# EAGLE design ethernetGateway (EAGLE 6.5.0)
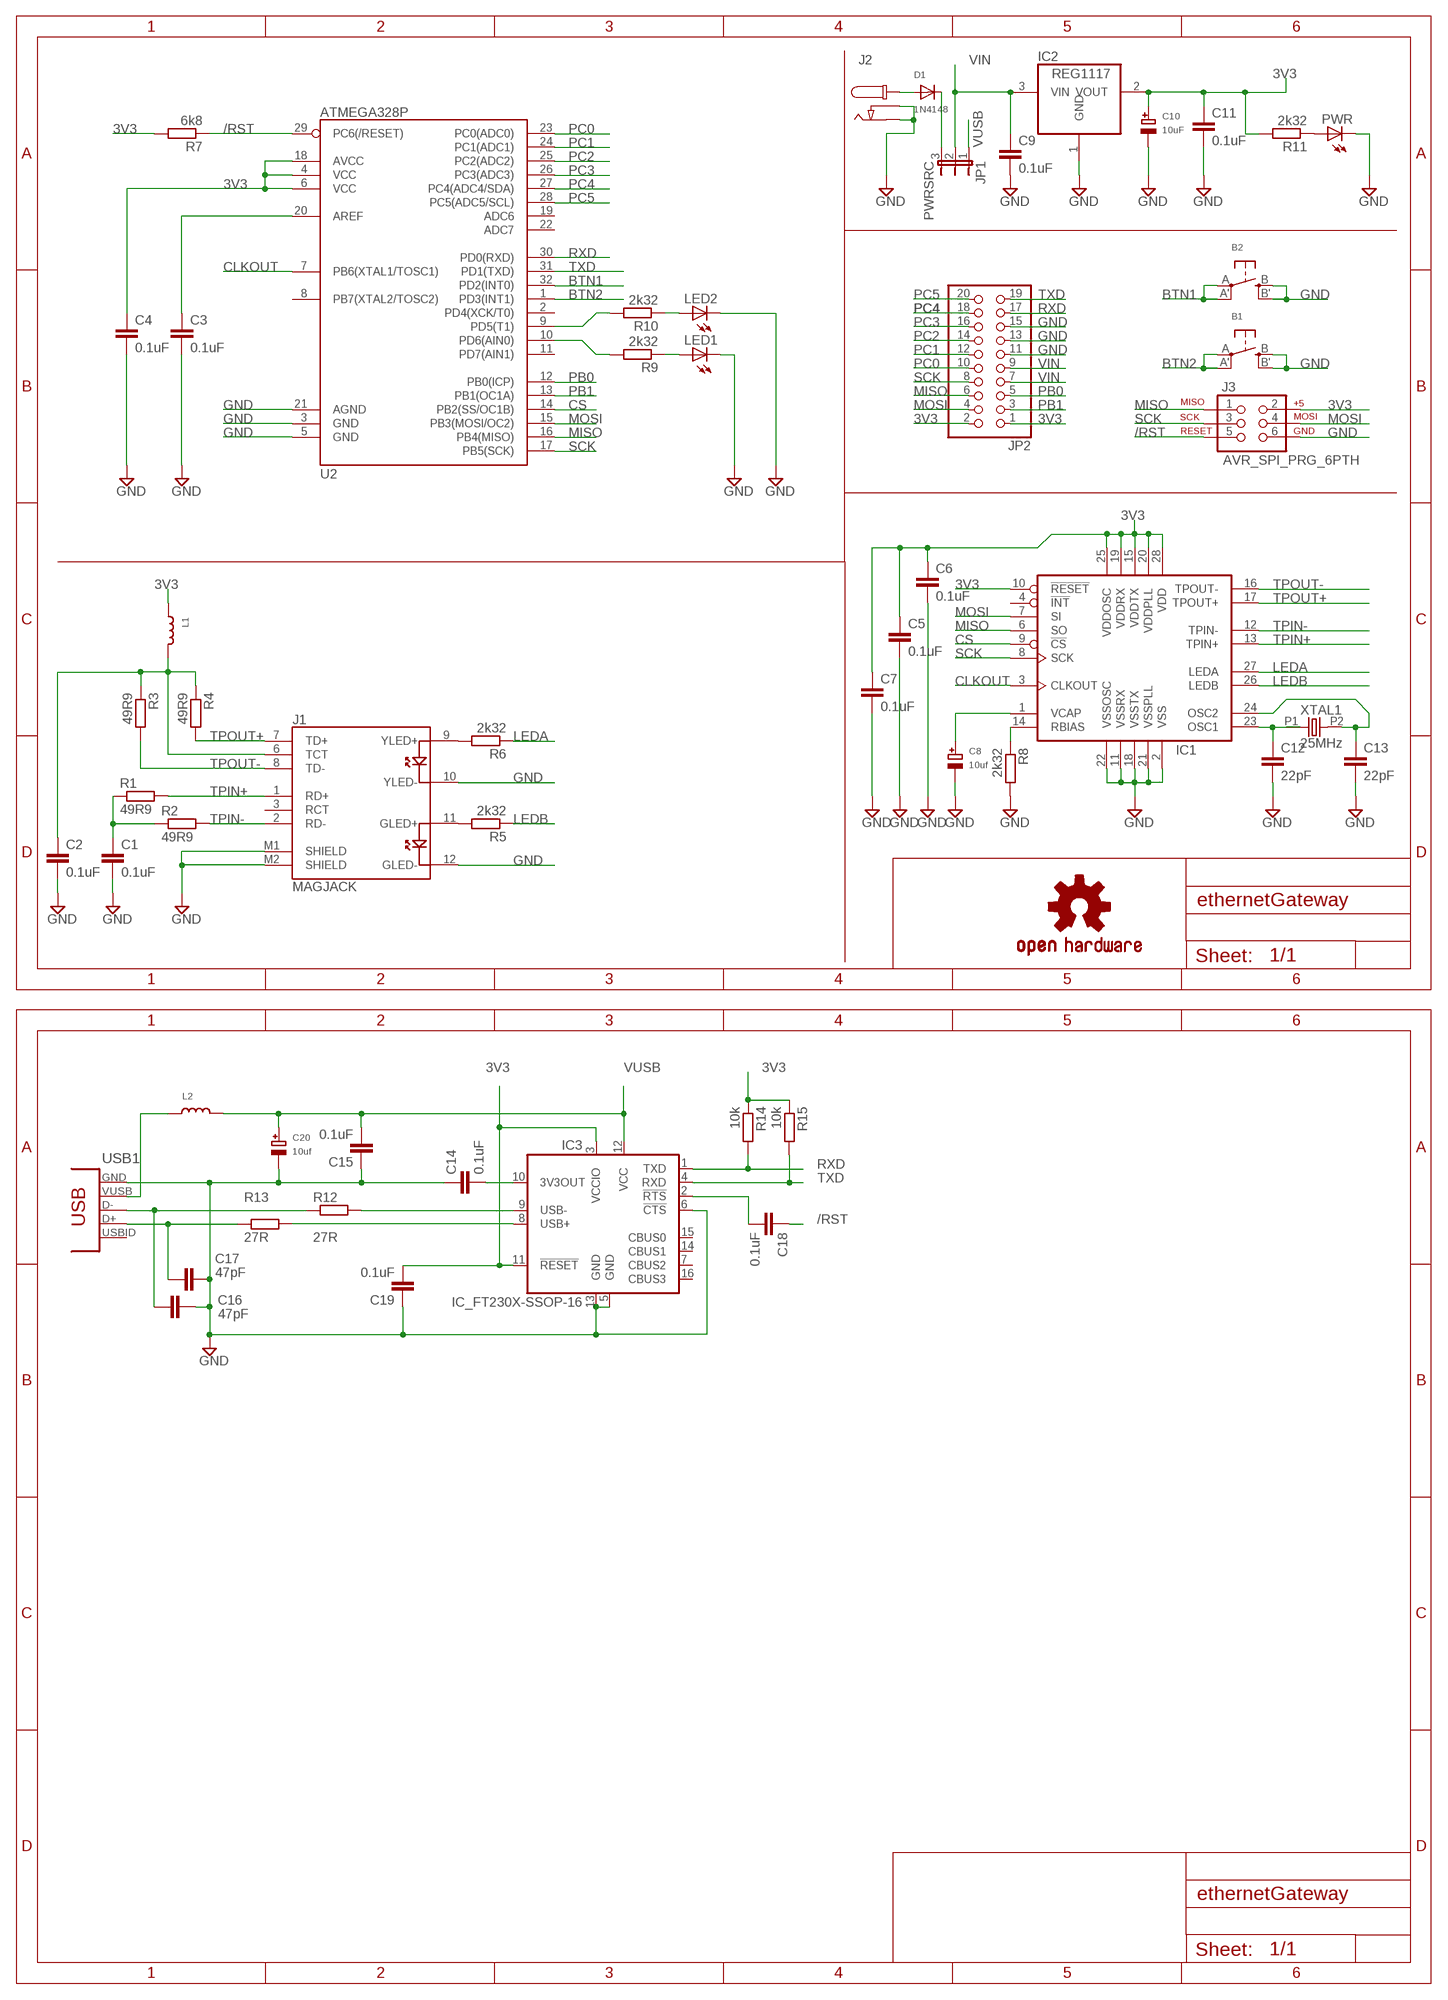
[diagram p0: schematic, sheet 1]

## Parts
B1  SWITCH_TACT_SMT4.6X2.8  [BTN_KMR2_4.6X2.8]
B2  SWITCH_TACT_SMT4.6X2.8  [BTN_KMR2_4.6X2.8]
C1  0.1uF  C-EUC0805  [C0805]
C2  0.1uF  C-EUC0805  [C0805]
C3  0.1uF  C-EUC0805  [C0805]
C4  0.1uF  C-EUC0805  [C0805]
C5  0.1uF  C-EUC0805  [C0805]
C6  0.1uF  C-EUC0805  [C0805]
C7  0.1uF  C-EUC0805  [C0805]
C8  10uf  CAP_TANTALUMD/7343_REFLOW  [EIA7343-31/D-R]
C9  0.1uF  C-EUC0805  [C0805]
C10  10uF  CAP_TANTALUMD/7343_REFLOW  [EIA7343-31/D-R]
C11  0.1uF  C-EUC0805  [C0805]
C12  22pF  C-EUC0805  [C0805]
C13  22pF  C-EUC0805  [C0805]
C14  0.1uF  C-EUC0805  [C0805]
C15  0.1uF  C-EUC0805  [C0805]
C16  47pF  C-EUC0805  [C0805]
C17  47pF  C-EUC0805  [C0805]
C18  0.1uF  C-EUC0805  [C0805]
C19  0.1uF  C-EUC0805  [C0805]
C20  10uf  CAP_TANTALUMD/7343_REFLOW  [EIA7343-31/D-R]
D1  1N4148  DIODESMA  [SMADIODE]
IC1  IC_ENC28J60-SOIC-28  [SOIC-28W]
IC2  REG1117  [SOT223]
IC3  IC_FT230X-SSOP-16  [SSOP-16-FTDI]
J1  MAGJACK  [MAGJACK]
J2  CON_DC_M-DC_PTH  [DC_BARREL_JACK_PTH_2MM]
J3  AVR_SPI_PRG_6PTH  [2X3]
JP1  PWRSRC  JP2W  [JP2W]
JP2  PINHD-2X10  [2X10]
L1  INDUCTOR0805  [0805]
L2  INDUCTOR0805  [0805]
LED1  LED-0805  [LED-805]
LED2  LED-0805  [LED-805]
LOGO1  OSHW-LOGOL  [OSHW-LOGO-L]
PWR  LED-0805  [LED-805]
R1  49R9  R-EU_R0805  [R0805]
R2  49R9  R-EU_R0805  [R0805]
R3  49R9  R-EU_R0805  [R0805]
R4  49R9  R-EU_R0805  [R0805]
R5  2k32  R-EU_R0805  [R0805]
R6  2k32  R-EU_R0805  [R0805]
R7  6k8  R-EU_R0805  [R0805]
R8  2k32  R-EU_R0805  [R0805]
R9  2k32  R-EU_R0805  [R0805]
R10  2k32  R-EU_R0805  [R0805]
R11  2k32  R-EU_R0805  [R0805]
R12  27R  R-EU_M0805  [M0805]
R13  27R  R-EU_M0805  [M0805]
R14  10k  R-EU_R0805  [R0805]
R15  10k  R-EU_R0805  [R0805]
U2  ATMEGA328P  ATMEGA328_SMT  [TQFP32-08]
USB1  CON-USB-F-MINI-B  [CONN_USB_MINI-B]
XTAL1  25MHz  OSC-XTAL-HC-49U-PTH  [HC-49U-PTH]

## Nets
3V3: C4.1 C5.1 C6.1 C7.1 C10.+ C11.1 C19.2 IC1.10(!RESET) IC1.15(VDDTX) IC1.19(VDDRX) IC1.20(VDDPLL) IC1.25(VDDOSC) IC1.28(VDD) IC2.2(VOUT) IC3.3(VCCIO) IC3.11(!RESET) J3.2 JP2.1 JP2.2 L1.1 R7.2 R11.2 R14.1 R15.1 U2.4(VCC) U2.6(VCC) U2.18(AVCC)
/RST: C18.1 J3.5 R7.1 U2.29(PC6(/RESET))
BTN1: B2.A'(P1) B2.A(P) U2.32(PD2(INT0))
BTN2: B1.A'(P1) B1.A(P) U2.1(PD3(INT1))
CLKOUT: IC1.3(CLKOUT) U2.7(PB6(XTAL1/TOSC1))
CS: IC1.9(!CS) U2.14(PB2(SS/OC1B))
GND: B1.B'(S1) B1.B(S) B2.B'(S1) B2.B(S) C1.2 C2.2 C3.2 C4.2 C5.2 C6.2 C7.2 C8.- C9.2 C10.- C11.2 C12.2 C13.2 C14.1 C15.1 C16.1 C17.2 C19.1 C20.- IC1.2(VSS) IC1.11(VSSRX) IC1.18(VSSTX) IC1.21(VSSPLL) IC1.22(VSSOSC) IC2.1(GND) IC3.5(GND) IC3.6(!CTS) IC3.13(GND) J1.10(YLED-) J1.12(GLED-) J1.M1(SHIELD) J1.M2(SHIELD) J2.P2(P3) J2.P3(P2) J3.6 JP2.11 JP2.13 JP2.15 LED1.C LED2.C PWR.C R8.2 U2.3(GND) U2.5(GND) U2.21(AGND) USB1.GND
LEDA: IC1.27(LEDA) R6.1
LEDB: IC1.26(LEDB) R5.1
MISO: IC1.6(SO) J3.1 JP2.6 U2.16(PB4(MISO))
MOSI: IC1.7(SI) J3.4 JP2.4 U2.15(PB3(MOSI/OC2))
N$1: C1.1 R1.1 R2.1
N$2: J1.9(YLED+) R6.2
N$3: C13.1 IC1.24(OSC2) XTAL1.P2
N$4: J1.11(GLED+) R5.2
N$5: C12.1 IC1.23(OSC1) XTAL1.P1
N$6: C16.2 R12.1 USB1.D-
N$7: C2.1 J1.6(TCT) L1.2 R3.1 R4.1
N$8: C17.1 R13.1 USB1.D+
N$9: IC3.9(USB-) R12.2
N$10: C8.+ IC1.1(VCAP)
N$11: IC3.8(USB+) R13.2
N$12: C3.1 U2.20(AREF)
N$13: IC1.14(RBIAS) R8.1
N$14: L2.1 USB1.VUSB
N$15: C14.2 IC3.10(3V3OUT)
N$16: LED1.A R9.1
N$17: LED2.A R10.1
N$18: D1.C JP1.3
N$19: D1.A J2.P1
N$20: C18.2 IC3.2(!RTS)
N$23: R10.2 U2.9(PD5(T1))
N$24: R9.2 U2.10(PD6(AIN0))
N$28: PWR.A R11.1
PB0: JP2.5 U2.12(PB0(ICP))
PB1: JP2.3 U2.13(PB1(OC1A))
PC0: JP2.10 U2.23(PC0(ADC0))
PC1: JP2.12 U2.24(PC1(ADC1))
PC2: JP2.14 U2.25(PC2(ADC2))
PC3: JP2.16 U2.26(PC3(ADC3))
PC4: JP2.18 U2.27(PC4(ADC4/SDA))
PC5: JP2.20 U2.28(PC5(ADC5/SCL))
RXD: IC3.1(TXD) JP2.17 R14.2 U2.30(PD0(RXD))
SCK: IC1.8(SCK) J3.3 JP2.8 U2.17(PB5(SCK))
TPIN+: IC1.13(TPIN+) J1.1(RD+) R1.2
TPIN-: IC1.12(TPIN-) J1.2(RD-) R2.2
TPOUT+: IC1.17(TPOUT+) J1.7(TD+) R4.2
TPOUT-: IC1.16(TPOUT-) J1.8(TD-) R3.2
TXD: IC3.4(RXD) JP2.19 R15.2 U2.31(PD1(TXD))
VIN: C9.1 IC2.3(VIN) JP1.2 JP2.7 JP2.9
VUSB: C15.2 C20.+ IC3.12(VCC) JP1.1 L2.2
Unconnected: IC1.4(!INT) IC3.7(CBUS2) IC3.14(CBUS1) IC3.15(CBUS0) IC3.16(CBUS3) J1.3(RCT) U2.2(PD4(XCK/T0)) U2.8(PB7(XTAL2/TOSC2)) U2.11(PD7(AIN1)) U2.19(ADC6) U2.22(ADC7) USB1.BODY@1(BODY) USB1.BODY@2(BODY) USB1.BODY@3(BODY) USB1.BODY@4(BODY) USB1.ID(USBID)

## Library data of the parts
B1 B2 = microbuilder:SWITCH_TACT_SMT: SMT Tact Switches 6x6mm - Digikey: P12940SCT-ND KMR2 (4.6x2.8mm) - Digikey: 401-1426-1-ND EVQ-PQHB55 - Light Touch, 160GF (4.5x4.5mm) - Digikey: P8090SCT-ND
C1-C7 C9 C11-C19 = rcl:C-EU: CAPACITOR, European symbol
C8 C10 C20 = microbuilder:CAP_TANTALUM: Tantalum Capacitors Wave footprints have larger pads and are meant to be used for hand soldering. Reflow footprints are optimised for solder paste and a reflow oven. EIA3216-18/A-[R/W] - Size A / 3216-18 / 1206 footprint 4.7µF 25V 10% Tantalum Capacitor 10µF 16V 10% Tantalum Capacitor [Digikey: 495-2236-2-ND] EIA3528-21/B-[R/W] - Size B / 3528-21 47µF 10V 10% Tantalum Capactior [Digikey: 495-2216-1-ND] EIA6032-28/C-[R/W] - Size C / 6032-28 10µF 35V 20% Tantalum Capacitor [Digikey: 495-2285-1-ND] 100µF 16V 10% Tantalum Capactior [Digikey: 399-5214-1-ND]
D1 = microbuilder:DIODE: Diode SMA Model Volts Amps Type Vf Vr Digikey # Notes SSA34-E3 40V 3A Schottky 480mV @ 3A 200uA @ 40V SSA34-E3/61TGITR-ND CDBA120-G 20V 1A Schottky 500mV @ 1A 500uA @ 20V 641-1014-6-ND REEL MBRA210 10V 2A Schottky 350mV @ 2A 700uA @ 10V MBRA210LT3 SOD-123 Model Volts Amps Type Vf Vr Order # Notes BAT54T1G 30V 200mA Schottky 800mV @ 200mA 2uA @ 25V BAT54T1GOSTR-ND B0530W 30V 500mA Schottky 430mV @ 500mA 130uA @ 30V B0530W-FDICT-ND REEL MBR120 1A 20V Schottky 340mV @ 1A MBR120VLSFT1GOSCT-ND SOD-323 Model Volts Amps Type Vf Vr Order # Notes PMEG2005EJ 20V 500mA Schottky 355mV @ 500mA 568-4110-1-ND ZLLS410 10V 570mA Schottky 380mV @ 570mA ZLLS410CT-ND 1N4148WS 75V 150mA Silicon/Simple 1V 1N4148WSFSCT-ND REEL SOD-523 Model Volts Amps Type Vf Vr Order # Notes BAT54XV2 30V 200mA Schottky 0.8V @ 100mA BAT54XV2CT-ND TB751S 30V 30mA Schottky RB751S-40TE61CT-ND SOT23-R/W (R = Solder Paste/Reflow Ovens, W = Hand-Soldering) Model Volts Amps Type Vf Vr Order # Notes BAT54FILM 40V 300mA Schottky 497-7162-1-ND
IC1 = dp_devices:IC_ENC28J60: Ethernet Controller with SPI Interface
IC2 = burr-brown:REG1117: 800mA and 1A Low Dropout (LDO) Positive Regulator 1.8V, 2.5V, 2.85V, 3.3V, 5V, and Adj; MPN: REG1117; OC_FARNELL: 1097566; OC_NEWARK: 14P6981
IC3 = dp_devices:IC_FT230X: BASIC USB to UART IC
J1 = SparkFun-Connectors:MAGJACK: RJ-45 with LEDs
J2 = dp_devices:CON_DC_M: DC power connector
J3 = SparkFun-Connectors:AVR_SPI_PRG_6: AVR ISP 6 Pin This is the reduced ISP connector for AVR programming. Common on Arduino. This footprint will take up less PCB space and can be used with a 10-pin to 6-pin adapter such as SKU: BOB-08508
JP1 = jumper:JP2W: JUMPER
JP2 = pinhead:PINHD-2X10: PIN HEADER
L1 L2 = microbuilder:INDUCTOR: Inductors 0603: 10nH Ceramic Inductor - microwire antenna/RF (Digikey: 712-1434-2-ND) 0805: 560nH Ceramic Inductor - RF (Digikey: 553-1047-1-ND) 270nH Ceramic Inductor - Q = 40@250MHz, +-5%, 1 Ohm DC Resistance (Digikey: 535-10506-2-ND) 1007 (2518 Metric) SMT: 10µH 10% 250mOhm 820mA 1007 Inductor (Digikey: 587-2189-1-ND) 22µH 10% 500mOhm 580mA 1007 Inductor (Digikey: 587-2190-1-ND) 47µH 10% 950mOhm 420mA 1007 Inductor (Digikey: 587-2191-1-ND) 47µH 5% 100mOhm 1A 1008 Inductor (Digikey: 732-1816-1-ND) 5.0x5.0mm (Taiyo Yuden NR5040 Series) 6.8µH 20% 2.3A 64mOhm Inductor (Digikey: 587-2374-2-ND) 5.0x5.0mm (TDK VLC5045 Series) 4.7µH 20% 3.3A 34mOhm Inductor (Digikey: 445-6526-1-ND) 6.8µH 20% 2.7A 46mOhm Inductor (Digikey: 445-6527-1-ND) 6.0x6.0mm (TDK VLC6045 Series) 4.7µH 20% 3.8A 27mOhm Inductor (Digikey: 445-6538-2-ND) 6.8µH 20% 3A 41mOhm Inductor (Digikey: 445-6540-1-ND) 6.2µH 30% 2.2A 45mOhm Inductor (Digikey: SRR5028-6R2YCT-ND) - Not TDK VLC6045 but footprint should match 6.0x6.0mm (TDK SLF6045 Series) 6.8uH 30% 2A 33mOhm Inductor (Digikey: 445-4572-1-ND, Mouser: 810-SLF645T6R8N2R0PF)
LED1 LED2 PWR = dp_devices:LED: Light Emitting Diode
LOGO1 = SparkFun-Aesthetics:OSHW-LOGO: Open Source Hardware Logo This logo indicates the piece of hardware it is found on incorporates a OSHW license and/or adheres to the definition of open source hardware found here: http://freedomdefined.org/OSHW
R1-R15 = rcl:R-EU_: RESISTOR, European symbol
U2 = SparkFun-DigitalIC_ihsan:ATMEGA328_SMT: 32-Pin Atmega328 part Commonly used on Arduino compatible boards Available in QFP and QFN packages TQFP is IC-09069 QFN is non-stock; PROD_ID: IC-09069
USB1 = dp_devices:CON-USB-F: USB Female connector
XTAL1 = dp_devices:OSC-XTAL

## Board
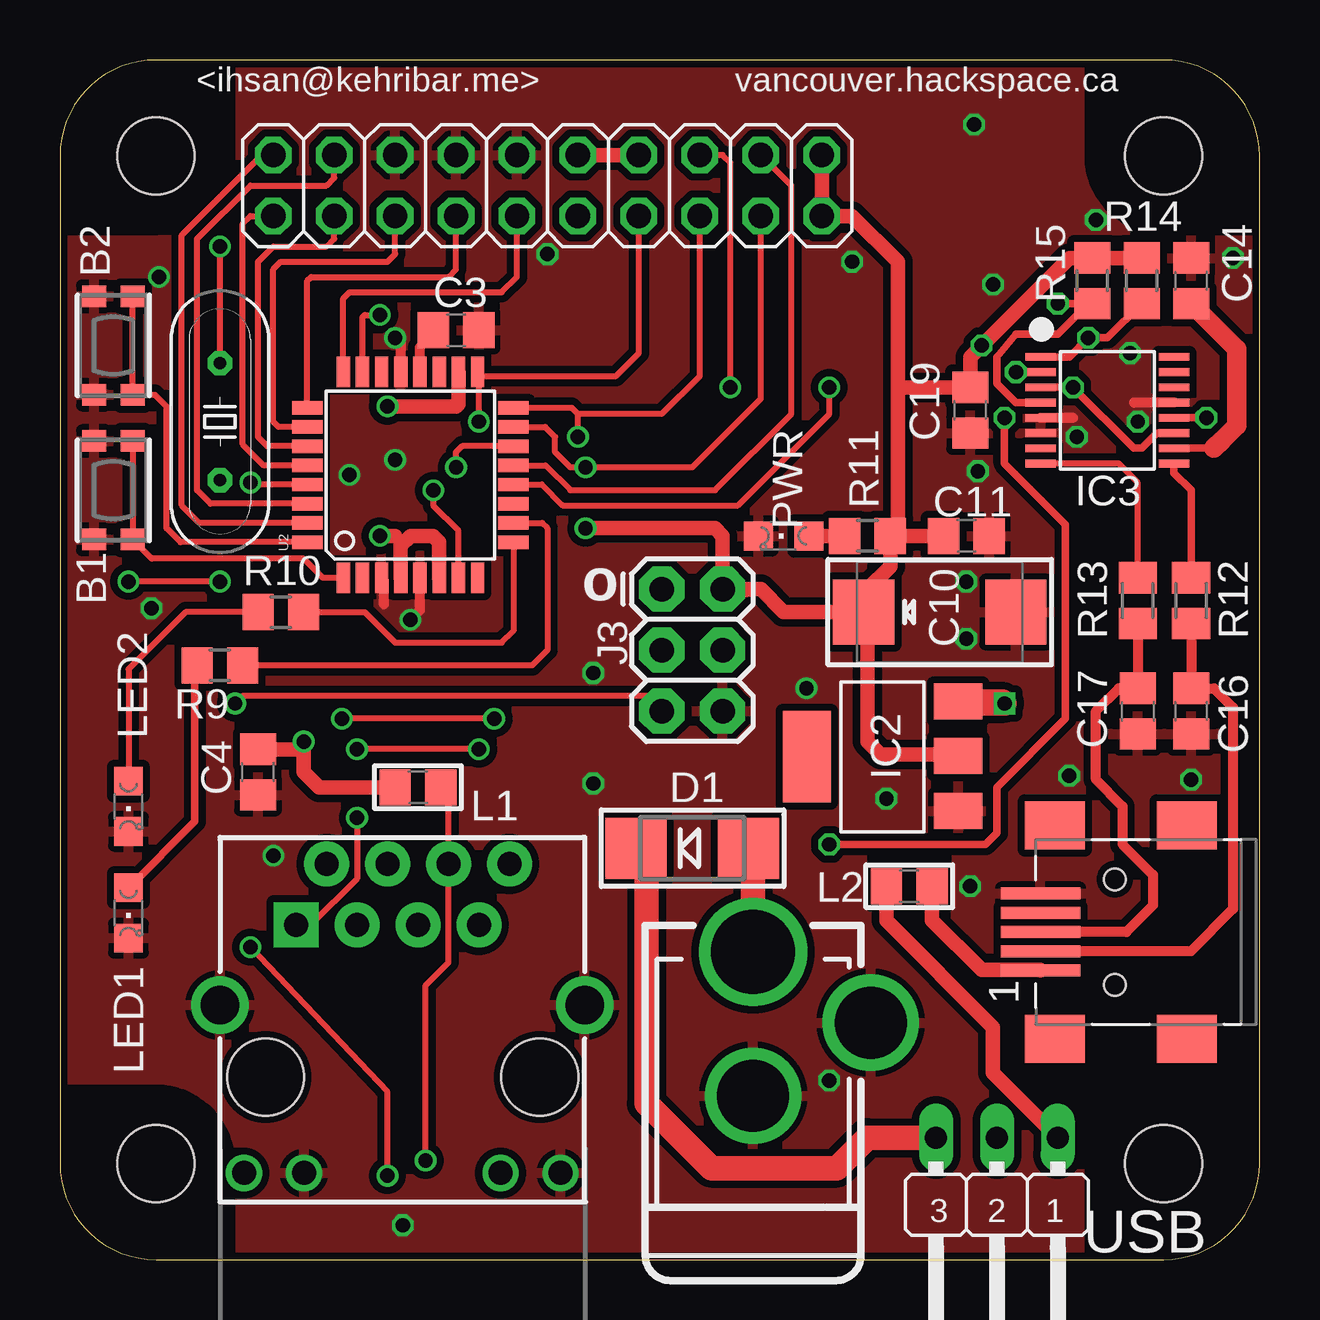
[diagram p1: board, top side]
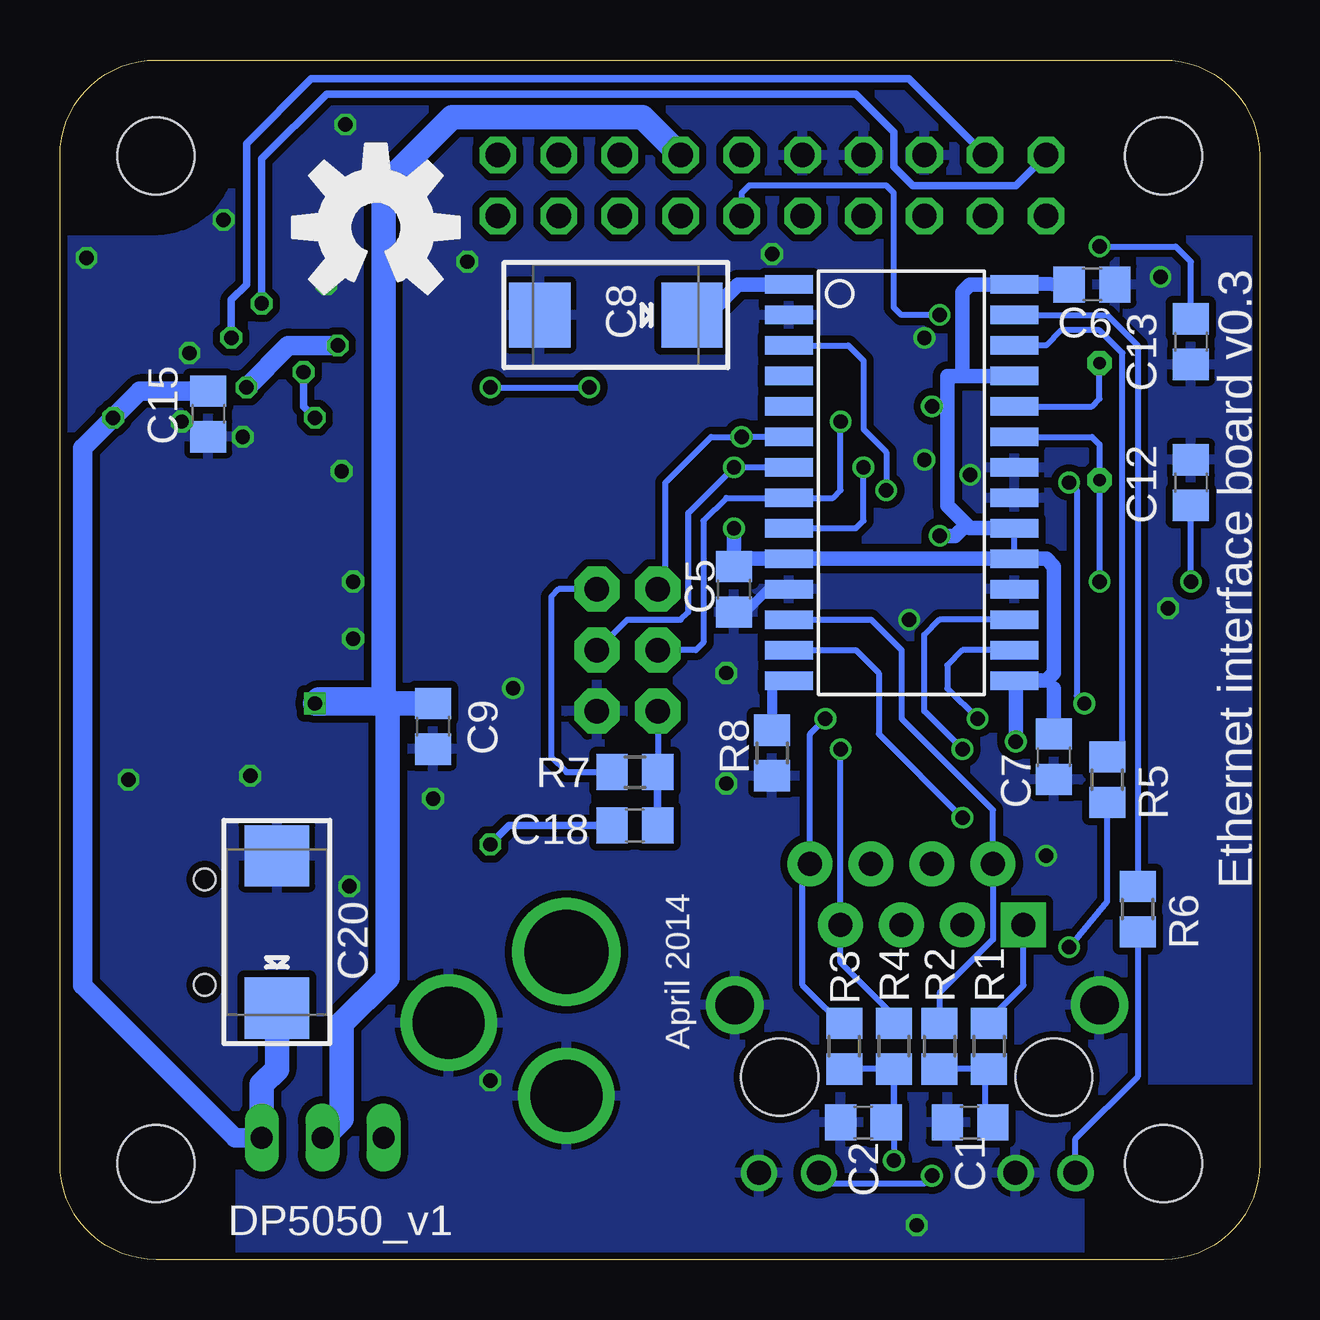
[diagram p2: board, bottom side, seen from below]

Size 50 x 50 mm. Coordinates in mm from the lower left corner, seen from the top.
Copper layers (1*16): Top 0.035mm / dielectric 1.5mm / Bottom 0.035mm
Design rules "ITEADstudio_DRC": minimum track width 6mil, minimum drill 12mil, track to track 6mil, track to pad 6mil, pad to pad 6mil, via to via 6mil, smd to smd 0mil, copper to edge 10mil, drill to drill 10mil, minimum pad ring 10mil, minimum via ring 6mil, stop-mask expansion 2mil, vias tented up to drill 100mil, thermal gap 10mil

### Footprints (pad centres in the part's own frame; a part is rotated, then mirrored left to right if it is on the bottom)
BTN_KMR2_4.6X2.8 = smd 0.9 x 1: A 2.05,0.8; A' -2.05,0.8; B 2.05,-0.8; B' -2.05,-0.8
C0805 = smd 1.3 x 1.5: 1 -0.95,0; 2 0.95,0
EIA7343-31/D-R = smd 2.55 x 2.7: + 3.175,0; - -3.175,0
SMADIODE = smd 2.54 x 2.54: A 2.349,0; C -2.349,0
SOIC-28W = smd 0.762 x 2: 1 -8.89,-4.7; 2 -7.62,-4.7; 3 -6.35,-4.7; 4 -5.08,-4.7; 5 -3.81,-4.7; 6 -2.54,-4.7; 7 -1.27,-4.7; 8 0,-4.7; 9 1.27,-4.7; 10 2.54,-4.7; 11 3.81,-4.7; 12 5.08,-4.7; 13 6.35,-4.7; 14 7.62,-4.7; 15 7.62,4.7; 16 6.35,4.7; 17 5.08,4.7; 18 3.81,4.7; 19 2.54,4.7; 20 1.27,4.7; 21 0,4.7; 22 -1.27,4.7; 23 -2.54,4.7; 24 -3.81,4.7; 25 -5.08,4.7; 26 -6.35,4.7; 27 -7.62,4.7; 28 -8.89,4.7
SOT223 = smd 1.499 x 2.007: 1 -2.261,-3.15; 2 0.025,-3.15; 3 2.311,-3.15 | smd 3.81 x 2.007: 4 0,3.15
SSOP-16-FTDI = smd 0.32 x 1.26: 1 -2.223,-2.779; 2 -1.588,-2.779; 3 -0.953,-2.779; 4 -0.318,-2.779; 5 0.317,-2.779; 6 0.952,-2.779; 7 1.587,-2.779; 8 2.222,-2.779; 9 2.222,2.779; 10 1.587,2.779; 11 0.952,2.779; 12 0.317,2.779; 13 -0.318,2.779; 14 -0.953,2.779; 15 -1.588,2.779; 16 -2.223,2.779
MAGJACK = drill 1 pad 1.88 square: 1 3.175,17.445 | drill 1 pad 1.88: 2 4.445,19.985; 3 5.715,17.445; 4 6.985,19.985; 5 8.255,17.445; 6 9.525,19.985; 7 10.795,17.445; 8 12.065,19.985 | drill 1 pad 1.27: 9 1,7.1; 10 3.5,7.1; 11 11.7,7.1; 12 14.2,7.1 | drill 1.6 pad 2.184: M1 0,14.1; M2 15.2,14.1 | hole 3.2: 1.905,11.095; 13.335,11.095
DC_BARREL_JACK_PTH_2MM = drill 3.5: P1 0,6.475 | drill 3: P2 4.9,3.525; P3 0,0.475
2X3 = drill 1.016 pad 1.88 octagon: 1 0,0; 2 0,2.54; 3 2.54,0; 4 2.54,2.54; 5 5.08,0; 6 5.08,2.54
JP2W = drill 0.914 long: 1 -2.54,-1.27; 2 0,-1.27; 3 2.54,-1.27
2X10 = drill 1.016 octagon: 1 -11.43,-1.27; 2 -11.43,1.27; 3 -8.89,-1.27; 4 -8.89,1.27; 5 -6.35,-1.27; 6 -6.35,1.27; 7 -3.81,-1.27; 8 -3.81,1.27; 9 -1.27,-1.27; 10 -1.27,1.27; 11 1.27,-1.27; 12 1.27,1.27; 13 3.81,-1.27; 14 3.81,1.27; 15 6.35,-1.27; 16 6.35,1.27; 17 8.89,-1.27; 18 8.89,1.27; 19 11.43,-1.27; 20 11.43,1.27
0805 = smd 1.3 x 1.5: 1 -0.95,0; 2 0.95,0
LED-805 = smd 1.2 x 1.2: A 0,-1.05; C 0,1.05
R0805 = smd 1.3 x 1.5: 1 -0.95,0; 2 0.95,0
M0805 = smd 1.3 x 1.6: 1 -0.95,0; 2 0.95,0
TQFP32-08 = smd 1.27 x 0.559: 1 -4.293,2.8; 2 -4.293,2; 3 -4.293,1.2; 4 -4.293,0.4; 5 -4.293,-0.4; 6 -4.293,-1.2; 7 -4.293,-2; 8 -4.293,-2.8; 17 4.293,-2.8; 18 4.293,-2; 19 4.293,-1.2; 20 4.293,-0.4; 21 4.293,0.4; 22 4.293,1.2; 23 4.293,2; 24 4.293,2.8 | smd 0.559 x 1.27: 9 -2.8,-4.293; 10 -2,-4.293; 11 -1.2,-4.293; 12 -0.4,-4.293; 13 0.4,-4.293; 14 1.2,-4.293; 15 2,-4.293; 16 2.8,-4.293; 25 2.8,4.293; 26 2,4.293; 27 1.2,4.293; 28 0.4,4.293; 29 -0.4,4.293; 30 -1.2,4.293; 31 -2,4.293; 32 -2.8,4.293
DP5050_V1 = hole 3.2: 4,4; 46,4; 46,46; 4,46
CONN_USB_MINI-B = smd 2 x 2.5: BODY@1 -4.45,2.5; BODY@2 4.45,2.5; BODY@3 4.45,-3; BODY@4 -4.45,-3 | smd 0.5 x 3.3: D+ 0,3.1; D- -0.8,3.1; GND 1.6,3.1; ID 0.8,3.1; VUSB -1.6,3.1 | hole 0.9: -2.2,0; 2.2,0
HC-49U-PTH = drill 0.508 octagon: P1 -2.44,0; P2 2.44,0

### Placement (x,y rotation side)
B1  2.22,32.07 270 top
B2  2.22,38.1 270 top
C1  12.06,5.71 180 bottom
C2  16.51,5.71 180 bottom
C3  16.51,38.73 0 top
C4  8.25,20.32 270 top
C5  21.91,27.94 270 bottom
C6  6.99,40.64 0 bottom
C7  8.57,20.96 270 bottom
C8  26.83,39.37 0 bottom
C9  34.45,22.23 270 bottom
C10  36.67,26.99 180 top
C11  37.78,30.16 0 top
C12  2.86,32.38 90 bottom
C13  2.86,38.26 270 bottom
C14  47.15,40.8 270 top
C15  43.81,35.24 90 bottom
C16  47.15,22.86 90 top
C17  44.93,22.86 270 top
C18  26.04,18.1 180 bottom
C19  37.94,35.4 90 top
C20  40.96,13.65 270 bottom
D1  26.35,17.14 0 top
IC1  14.92,31.75 270 bottom
IC2  34.29,20.96 90 top
IC3  43.66,35.4 270 top
J1  6.67,-3.49 0 top
J2  28.89,6.35 0 top
J3  25.08,27.94 270 top
JP1  39.05,3.81 180 top
JP2  20.32,44.77 180 top
L1  14.92,19.69 0 top
L2  35.4,15.56 180 top
LED1  2.86,14.45 180 top
LED2  2.86,18.89 180 top
LOGO1  36.83,43.02 0 bottom
PWR  30.16,30.16 90 top
R1  11.27,8.89 90 bottom
R2  13.33,8.89 90 bottom
R3  17.3,8.89 90 bottom
R4  15.24,8.89 90 bottom
R5  6.35,20 270 bottom
R6  5.08,14.6 270 bottom
R7  26.04,20.32 180 bottom
R8  20.32,21.11 270 bottom
R9  6.67,24.77 0 top
R10  9.21,26.99 0 top
R11  33.65,30.16 0 top
R12  47.15,27.46 90 top
R13  44.93,27.46 90 top
R14  45.09,40.8 270 top
R15  43.02,40.8 270 top
U2  14.6,32.7 90 top
U$1  [DP5050_V1]  0,0 0 top
USB1  43.97,13.65 90 top
XTAL1  6.67,34.93 90 top

### Tracks (layer width: path | path; a pad name or v marks a point on that pad's centre or on a via)
3V3  (via drill 0.6)
  Top 0.254: 14.21,29.93 13.97,30.16
  Top 0.305: IC3.3 v42.23,36.35 44.77,33.81 45.09,33.81 45.72,34.45 IC3.11
  Top 0.61: 14.21,29.76 14.6,30.16 15.56,30.16 15.8,29.92 U2.6 | 13.97,30.16 v13.33,30.16 | v13.65,35.56 16.51,35.56 16.6,35.66 U2.18 | L1.1 10.8,19.69 10.16,20.32 v10.16,21.59 10.16,21.27 C4.1 | v21.91,30.48 27.3,30.48 27.62,30.16 J3.2 | 28.61,27.9 28.89,27.94 J3.2 | JP2.1 JP2.2 33.02,43.5 34.92,41.59 34.92,36.35 | C10.+ 33.65,26.95 33.65,21.59 34.2,21.04 37.44,21.04 IC2.2 | C10.+ 30.16,26.99 29.21,27.94 J3.2 | C11.1 R11.2 | C10.+ 33.62,27.9 34.61,28.89 R11.2 | 34.92,36.35 34.92,30.48 R11.2 | 14.21,29.76 U2.4 | 14.21,29.76 14.21,29.93 | R14.1 R15.1 42.07,41.75 v38.42,38.1 37.94,37.62 C19.2 | C19.2 | C19.2 34.92,36.35
  Bottom 0.254: IC1.19 IC1.20 | 12.07,36.83 12.38,37.15 | 10.16,24.07 IC1.15 | 8.57,23.81 8.89,24.13 | 21.91,29.21 C5.1 | 10.16,40.7 IC1.28 | J3.2 29.21,27.94 29.53,27.62 29.53,20.96 28.89,20.32 R7.2
  Bottom 0.61: IC1.20 12.07,30.48 12.22,30.64 | 12.22,30.64 13.02,31.43 13.02,35.56 | 13.02,35.56 13.02,36.83 12.07,36.83 IC1.25 | 12.38,37.15 12.38,40.32 12.07,40.64 IC1.28 | v10.16,21.59 10.16,24.07 | IC1.15 8.89,24.13 8.57,24.45 8.57,28.89 8.89,29.21 IC1.19 IC1.10 21.91,29.21 | v13.33,30.16 12.7,30.16 12.22,30.64 | v13.65,35.56 13.02,35.56 | C7.1 8.57,23.81 | C6.1 10.16,40.7 | C5.1 v21.91,30.48
  Bottom 0.813: v42.23,36.35 40.48,38.1 v38.42,38.1
/RST  (via drill 0.6)
  Top 0.254: J3.5 25.08,23.18 24.76,23.5 7.62,23.5 v7.3,23.18 | U2.29 8.02,32.3 v7.94,32.38
  Bottom 0.254: J3.5 R7.1 | v7.94,32.38 7.62,32.07 7.62,23.5 v7.3,23.18
  Bottom 0.305: C18.1 R7.1
BTN1
  Top 0.254: U2.32 5.02,29.9 4.45,30.48 4.45,35.56 3.95,36.05 B2.A B2.A'
BTN2
  Top 0.254: B1.A' B1.A 3.83,29.21 10.16,29.21 10.96,28.41 U2.1
CLKOUT  (via drill 0.6)
  Top 0.254: v15.56,32.07 15.56,31.43 16.6,30.39 U2.7
  Bottom 0.254: IC1.3 17.14,38.1 16.51,37.47 16.51,34.61 15.56,33.66 v15.56,32.07
CS  (via drill 0.6)
  Top 0.254: v16.51,33.02 16.51,33.66 16.76,33.9 U2.14
  Bottom 0.254: IC1.9 16.83,30.48 16.51,30.8 v16.51,33.02
GND  (via drill 0.6)
  Top 0.406: v14.6,26.67 15,27.07 U2.5 | U2.3 13.49,28.32 13.49,27.3 | v13.97,38.42 14.21,38.18 U2.21 | IC3.5 42.23,35.08 | IC3.13 44.77,35.72
  Bottom 0.406: IC1.11 20.48,27.94 21.43,26.99 C5.2
  other vias: 12.06,32.7 8.89,16.83 13.97,33.34 22.23,24.45 31.12,23.81 4.13,40.96 38.1,47.31 3.81,27.15 32.07,7.46 34.45,19.21 14.29,1.43 33.02,41.59 22.23,19.84 20.32,41.91 47.15,20 42.07,20.16 42.39,34.29 37.94,15.56 38.26,32.86 37.78,25.88 37.78,28.26 44.61,37.78 48.89,41.75 38.89,40.64 43.18,43.34 44.93,34.93
  pour Top (isolate 0.305): -0.16,50.16 -0.16,-0.16 50.32,-0.16 50.32,50.16
  pour Bottom (isolate 0.305): -0.16,50.16 -0.16,-0.16 50.32,-0.16 50.32,50.16
LEDA
  Bottom 0.254: IC1.27 6.35,39.37 5.08,38.1 R6.1
LEDB
  Bottom 0.254: R5.1 5.71,21.59 5.71,37.78 6.67,38.73 8.25,38.73 8.89,38.1 IC1.26
MISO  (via drill 0.6)
  Top 0.254: v21.59,34.29 21.59,35.24 | U2.16 21.33,35.5 21.59,35.24 | 21.59,35.24 25.08,35.24 26.67,36.83 JP2.6
  Bottom 0.254: IC1.6 v21.59,34.29 22.86,34.29 24.76,32.38 24.76,28.26 J3.1
MOSI  (via drill 0.6)
  Top 0.254: U2.15 20.23,34.7 20.64,34.29 20.64,33.66 21.27,33.02 v21.91,33.02 26.35,33.02 29.21,35.88 JP2.4
  Bottom 0.254: IC1.7 v21.91,33.02 23.81,31.12 23.81,26.99 24.13,26.67 26.35,26.67 J3.4
N$1
  Bottom 0.254: C1.1 11.43,5.71 11.43,7.62 R1.1 R2.1
N$2
  Bottom 0.254: R6.2 5.08,7.62 7.67,5.03 J1.9
N$3  (via drill 0.6)
  Top 0.254: XTAL1.P2 v6.67,42.23
  Bottom 0.254: IC1.24 6.99,35.56 6.67,35.88 XTAL1.P2 | v6.67,42.23 3.49,42.23 2.86,41.59 C13.1
N$4  (via drill 0.6)
  Top 0.254: v13.65,3.49 13.65,6.99 v7.94,13.02
  Bottom 0.254: J1.11 18.3,3.61 18.1,3.17 13.97,3.17 v13.65,3.49 | v7.94,13.02 6.35,14.92 R5.2
N$5  (via drill 0.6)
  Top 0.254: v6.67,28.26 v2.86,28.26
  Bottom 0.254: IC1.23 6.99,34.29 6.67,33.97 XTAL1.P1 v6.67,28.26 | v2.86,28.26 C12.1
N$6
  Top 0.406: R12.1 C16.2 48.1,23.81 48.89,23.02 48.89,14.6 47.14,12.85 USB1.D-
N$7  (via drill 0.6)
  Top 0.254: v15.24,4.13 15.24,11.43 16.19,12.38 J1.6 16.19,19.37 L1.2
  Bottom 0.254: C2.1 15.24,5.71 15.24,7.62 R4.1 | R4.1 R3.1 | R4.1 v15.24,4.13
N$8
  Top 0.406: R13.1 C17.1 44.13,23.81 43.18,22.86 43.18,20 44.29,18.89 44.29,17.3 45.56,16.03 45.56,14.76 44.45,13.65 USB1.D+
N$9
  Top 0.305: R12.2 47.15,32.07 46.44,32.78 IC3.9
N$10
  Bottom 0.254: IC1.1 19.62,40.7
  Bottom 0.61: 19.62,40.7 20.64,40.64 21.75,40.64 23.02,39.37 C8.+
N$11
  Top 0.254: R13.2 44.93,32.38 44.13,33.18 IC3.8
N$12
  Top 0.254: 15,38.02 C3.1
  Top 0.406: U2.20 15,38.02
N$13
  Bottom 0.254: IC1.14 20,24.13 20.32,23.81
  Bottom 0.406: 20.32,23.81 R8.1
N$14
  Top 0.61: USB1.VUSB 38.42,12.06 36.35,14.13 L2.1
N$15
  Top 0.305: IC3.10 48.1,33.81
  Top 0.813: 48.1,33.81 48.42,34.13 49.05,34.77 49.05,37.94 C14.2
N$16
  Top 0.254: 5.62,24.55 R9.1
  Top 0.305: 5.62,24.55 5.62,18.26 LED1.A
N$17
  Top 0.254: R10.1 5.24,26.99 2.86,24.61 LED2.A
N$18
  Top 1.016: D1.C 24.45,16.7 24.45,6.51 27.15,3.81 32.39,3.81 33.65,5.08 JP1.3
N$19
  Top 1.016: D1.A 28.89,16.96 J2.P1
N$20  (via drill 0.6)
  Top 0.305: v32.07,17.3 38.58,17.3 39.05,17.78 39.05,19.69 41.91,22.54 41.91,30.64 39.37,33.18 v39.37,35.08 | v39.85,36.99 | v39.85,36.99 IC3.2
  Bottom 0.305: v32.07,17.3 31.27,18.1 C18.2 | v39.37,35.08 39.85,35.56 v39.85,36.99
N$23
  Top 0.254: U2.9 18.9,26.2 18.42,25.72 13.97,25.72 12.7,26.99 R10.2
N$24
  Top 0.254: U2.10 20.1,30.7 20.32,30.48 20.32,25.4 19.69,24.77 R9.2
N$28
  Top 0.61: R11.1 PWR.A
PB0  (via drill 0.6)
  Top 0.254: U2.12 20.08,32.3 20.96,31.43 28.26,31.43 32.07,35.24 v32.07,36.35 | v27.94,36.35 27.94,45.72 27.62,46.04 JP2.5
  Bottom 0.254: v32.07,36.35 v27.94,36.35
PB1
  Top 0.254: U2.13 20.24,33.1 21.27,32.07 27.3,32.07 30.48,35.24 30.48,44.77 JP2.3
PC0  (via drill 0.6)
  Top 0.254: U2.23 12.6,39.27 12.7,39.37 v13.33,39.37
  Bottom 0.254: v13.33,39.37 14.92,39.37 15.24,39.69 15.24,44.45 15.56,44.77 21.27,44.77 21.59,44.45 JP2.10
PC1
  Top 0.254: U2.24 11.81,40.06 12.07,40.32 18.42,40.32 19.05,40.96 JP2.12
PC2
  Top 0.254: U2.25 10.31,40.79 10.48,40.96 16.19,40.96 16.51,41.27 JP2.14
PC3
  Top 0.254: U2.26 9.11,34.7 8.89,34.93 8.89,41.27 9.21,41.59 13.65,41.59 13.97,41.91 JP2.16
PC4
  Top 0.254: U2.27 8.64,33.9 8.25,34.29 8.25,41.59 8.89,42.23 11.11,42.23 11.43,42.55 JP2.18
PC5
  Top 0.254: U2.28 8.49,33.1 7.62,33.97 7.62,43.18 7.94,43.5 JP2.20
RXD  (via drill 0.6)
  Top 0.254: U2.30 6.28,31.5 5.71,32.07 5.71,42.55 7.94,44.77 11.11,44.77 11.43,45.09 JP2.17
  Top 0.305: IC3.1 42.07,37.62 v42.86,38.42 43.65,38.42 R14.2
  Bottom 0.305: v42.86,38.42 42.86,40.01 42.23,40.64 42.23,46.51 39.53,49.21 14.6,49.21 JP2.17
SCK  (via drill 0.6)
  Top 0.254: v17.46,34.93 17.46,36.83 | 17.46,36.83 17.46,36.94 U2.17 17.41,37.41 17.46,36.83 | 17.46,36.83 23.18,36.83 24.13,37.78 JP2.8
  Bottom 0.254: v17.46,34.93 17.46,32.07 17.78,31.75 IC1.8 22.23,31.75 23.18,30.8 23.18,25.72 23.49,25.4 J3.3
TPIN+  (via drill 0.6)
  Top 0.254: v12.38,18.42 12.38,15.88 10.48,13.97 9.86,13.97 J1.1
  Bottom 0.254: R1.2 11.43,9.84 9.84,11.43 J1.1 | v12.38,18.42 15.87,21.91 15.87,24.45 16.83,25.4 IC1.13
TPIN-
  Bottom 0.254: R2.2 13.33,11.11 11.11,13.33 J1.2 11.11,18.73 14.92,22.54 14.92,25.4 16.19,26.67 IC1.12
TPOUT+  (via drill 0.6)
  Top 0.254: v17.46,21.27 v12.38,21.27
  Bottom 0.254: R4.2 15.24,10.16 17.46,12.38 J1.7 v17.46,21.27 | v12.38,21.27 13.97,22.86 13.97,26.04 13.33,26.67 IC1.17
TPOUT-  (via drill 0.6)
  Top 0.254: v18.1,22.54 v11.75,22.54
  Bottom 0.254: R3.2 17.14,9.53 19.05,11.43 19.05,16.18 J1.8 18.73,21.91 v18.1,22.54 | v11.75,22.54 13.02,23.81 13.02,24.77 12.38,25.4 IC1.16
TXD  (via drill 0.6)
  Top 0.254: U2.31 5.81,30.7 5.08,31.43 5.08,42.7 8.41,46.04 JP2.19
  Top 0.305: R15.2 43.02,39.53 | IC3.4 39.85,35.72 39.05,36.51 39.05,37.62 39.85,38.58 41.59,38.58 42.86,39.85 R15.2 | v41.59,39.85 v41.6,39.85 R15.2
  Bottom 0.305: v41.59,39.85 41.59,45.88 38.89,48.58 16.83,48.58 15.24,46.99 15.24,45.56 14.45,44.77 10.16,44.77 JP2.19
VIN  (via drill 0.6)
  Top 0.61: JP2.9 JP2.7
  Top 1.016: v39.37,23.18 39.28,23.27 IC2.3 37.53,23.18 v39.37,23.18
  Bottom 1.016: 36.51,23.18 36.51,44.77 33.65,47.62 25.72,47.62 JP2.7 | 36.51,23.18 v39.37,23.18 39.21,23.34 36.35,23.34 36.35,11.75 38.26,9.84 38.26,5.87 JP1.2 | C9.1 36.51,23.18
VUSB  (via drill 0.6)
  Top 0.305: IC3.12 | IC3.12 v47.78,35.08
  Top 0.61: L2.2 34.45,14.13 38.89,9.68 38.89,7.78 JP1.1
  Bottom 0.813: JP1.1 42.7,5.08 49.05,11.43 49.05,33.81 v47.78,35.08 46.67,36.19 C15.2
  Bottom 1.016: C20.+ 40.96,7.94 41.59,7.3 JP1.1

### Text on the board
tPlace: <ihsan@kehribar.me> | vancouver.hackspace.ca
bPlace: Ethernet interface board v0.3 | April 2014
tNames: o | USB